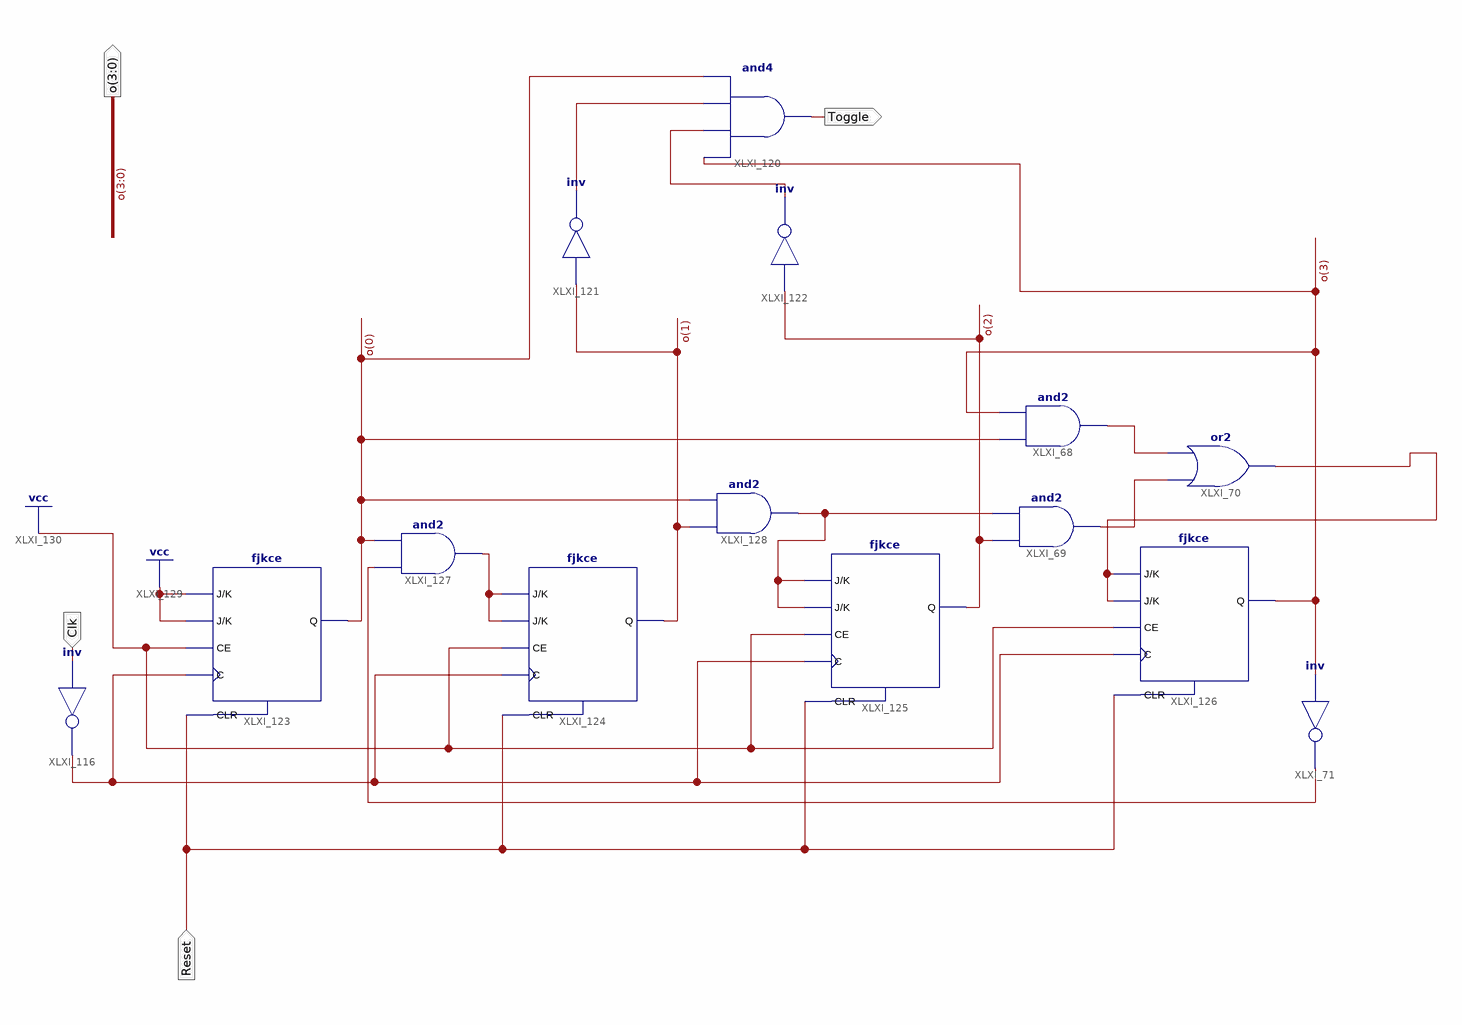
[diagram p0: schematic sheet 1]
// Xilinx ISE schematic Counter0_9C.sch (spartan6) as structural Verilog: 14 symbols, 4 ports
module Counter0_9C (
  input  Clk,
  input  Reset,
  output Toggle,
  output [3:0] o
);

  wire XLXN_85, XLXN_86, XLXN_91, XLXN_122, XLXN_125, XLXN_126, XLXN_142, XLXN_147, XLXN_148;

  and XLXI_68 (XLXN_125, o[0], o[3]);
  not XLXI_71 (XLXN_85, o[3]);
  and XLXI_69 (XLXN_122, o[2], XLXN_91);
  or XLXI_70 (XLXN_126, XLXN_122, XLXN_125);
  not XLXI_116 (XLXN_142, Clk);
  and XLXI_120 (Toggle, o[3], XLXN_148, XLXN_147, o[0]);
  not XLXI_121 (XLXN_147, o[1]);
  not XLXI_122 (XLXN_148, o[2]);
  fjkce XLXI_123 (.C(XLXN_142), .CE(1'b1), .CLR(Reset), .J(1'b1), .K(1'b1), .Q(o[0]));
  fjkce XLXI_124 (.C(XLXN_142), .CE(1'b1), .CLR(Reset), .J(XLXN_86), .K(XLXN_86), .Q(o[1]));
  fjkce XLXI_125 (.C(XLXN_142), .CE(1'b1), .CLR(Reset), .J(XLXN_91), .K(XLXN_91), .Q(o[2]));
  fjkce XLXI_126 (.C(XLXN_142), .CE(1'b1), .CLR(Reset), .J(XLXN_126), .K(XLXN_126), .Q(o[3]));
  and XLXI_127 (XLXN_86, XLXN_85, o[0]);
  and XLXI_128 (XLXN_91, o[1], o[0]);
endmodule
